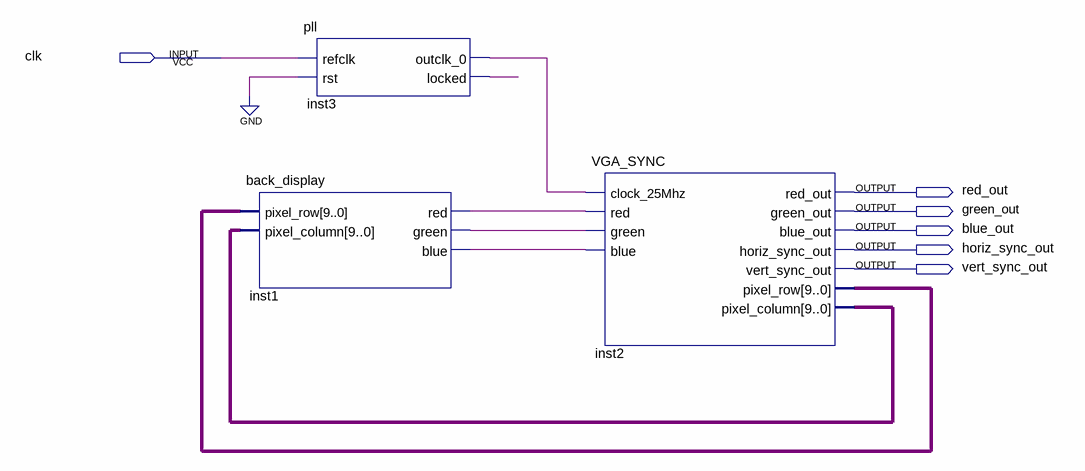
[diagram p0: schematic sheet]
// Quartus schematic vga_example1.bdf as structural Verilog: 3 symbols, 6 pins
module vga_example1 (
  input  clk,
  output red_out,
  output green_out,
  output blue_out,
  output horiz_sync_out,
  output vert_sync_out
);

  wire inst1_blue, inst1_green, inst1_red, inst3_locked, inst3_outclk_0;
  wire [9:0] inst2_pixel_column, inst2_pixel_row;

  back_display inst1 (
    .pixel_row(inst2_pixel_row), .pixel_column(inst2_pixel_column), .red(inst1_red), .green(inst1_green),
    .blue(inst1_blue));
  pll inst3 (.refclk(clk), .rst(1'b0), .outclk_0(inst3_outclk_0), .locked(inst3_locked));
  VGA_SYNC inst2 (
    .clock_25Mhz(inst3_outclk_0), .red(inst1_red), .green(inst1_green), .blue(inst1_blue), .red_out(red_out),
    .green_out(green_out), .blue_out(blue_out), .horiz_sync_out(horiz_sync_out),
    .vert_sync_out(vert_sync_out), .pixel_row(inst2_pixel_row), .pixel_column(inst2_pixel_column));
endmodule
